# EAGLE schematic cell (EAGLE 7.1.0)
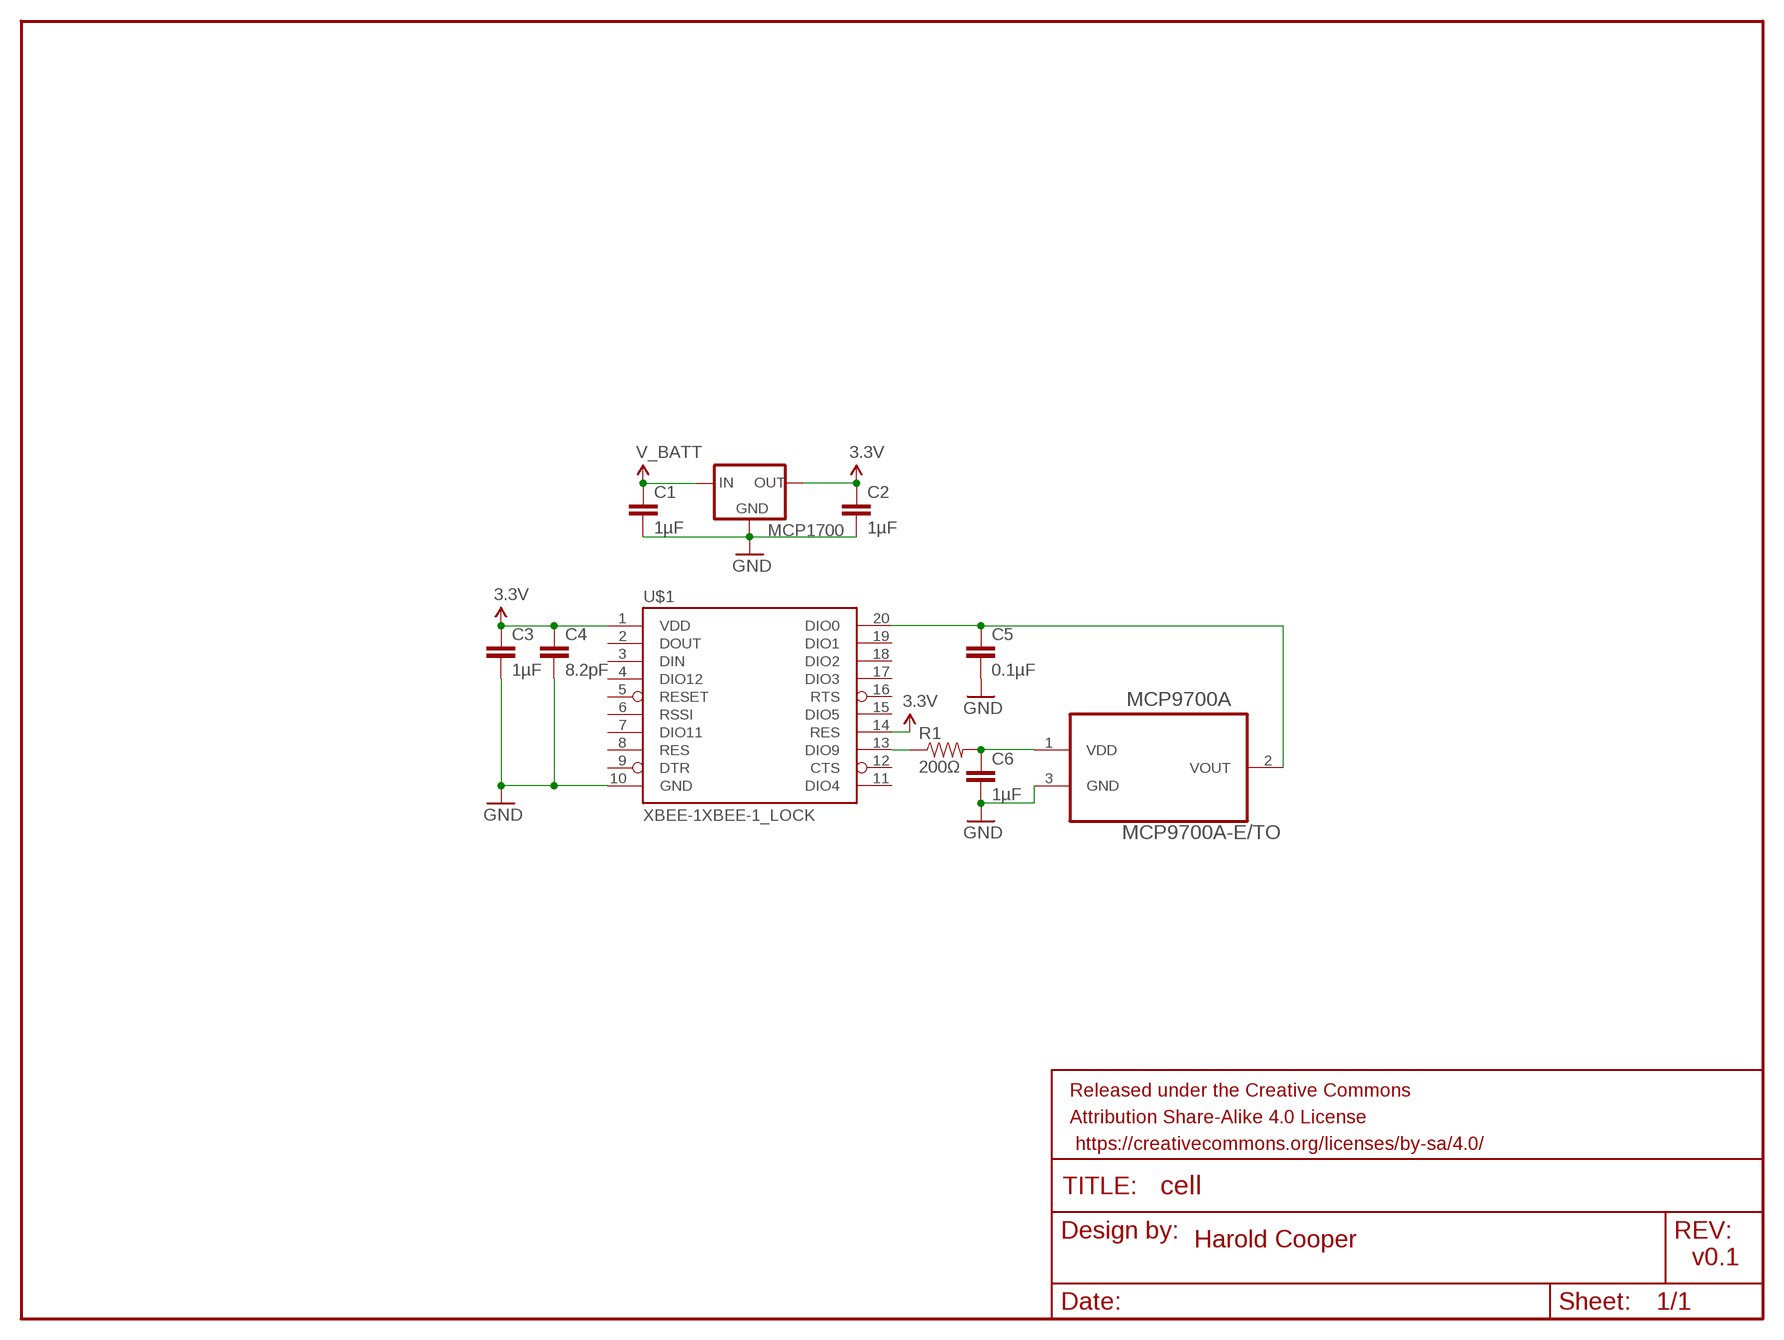
[diagram p0: schematic, sheet 1]

## Parts
C1  1µF  CAP0805  [0805]
C2  1µF  CAP0805  [0805]
C3  1µF  CAP0805  [0805]
C4  8.2pF  CAP0805  [0805]
C5  0.1µF  CAP0805  [0805]
C6  1µF  CAP0805  [0805]
FRAME1  FRAME-LETTER  [CREATIVE_COMMONS]
MCP1700  MCP1700INLINE  [TO92-INLINE]
MCP9700A  MCP9700A-E/TO  [TO127P254X533-3]
R1  200Ω  RESISTOR0805-RES  [0805]
U$1  XBEE-1XBEE-1_LOCK  [XBEE-1_LOCK]

## Nets
3.3V: C2.1 C3.1 C4.1 MCP1700.3(OUT) U$1.1(VDD) U$1.14(RES)
GND: C1.2 C2.2 C3.2 C4.2 C5.2 C6.2 MCP1700.1(GND) MCP9700A.3(GND) U$1.10(GND)
N$1: C6.1 MCP9700A.1(VDD) R1.2
N$2: R1.1 U$1.13(DIO9)
N$3: C5.1 MCP9700A.2(VOUT) U$1.20(DIO0)
V_BATT: C1.1 MCP1700.2(IN)
Unconnected: U$1.2(DOUT) U$1.3(DIN) U$1.4(DIO12) U$1.5(RESET) U$1.6(RSSI) U$1.7(DIO11) U$1.8(RES) U$1.9(DTR) U$1.11(DIO4) U$1.12(CTS) U$1.15(DIO5) U$1.16(RTS) U$1.17(DIO3) U$1.18(DIO2) U$1.19(DIO1)

## Notes on the sheet
- Harold Cooper
- v0.1

## Library data of the parts
C1-C6 = SparkFun-Capacitors:CAP: Capacitor Standard 0603 ceramic capacitor, and 0.1" leaded capacitor.
FRAME1 = SparkFun-Aesthetics:FRAME-LETTER: Schematic Frame Standard 8.5x11 US Letter frame
MCP1700 = adafruit:MCP1700: VOLTAGE REGULATOR
MCP9700A = Microchip_By_element14_Batch_1:MCP9700A-E/TO: THERMISTOR, LINEAR 10MV/C; MPN: MCP9700A-E/TO; OC_FARNELL: 1332164; OC_NEWARK: 17M0676; PACKAGE: TO-92-3; SUPPLIER: Microchip
R1 = SparkFun-Resistors:RESISTOR: Resistor Basic schematic elements and footprints for 0603, 1206, and PTH resistors.
U$1 = SparkFun-RF:XBEE-1: Xbee module footprints SMT header is CONN-09042.